# Altium project imu.PrjPcb
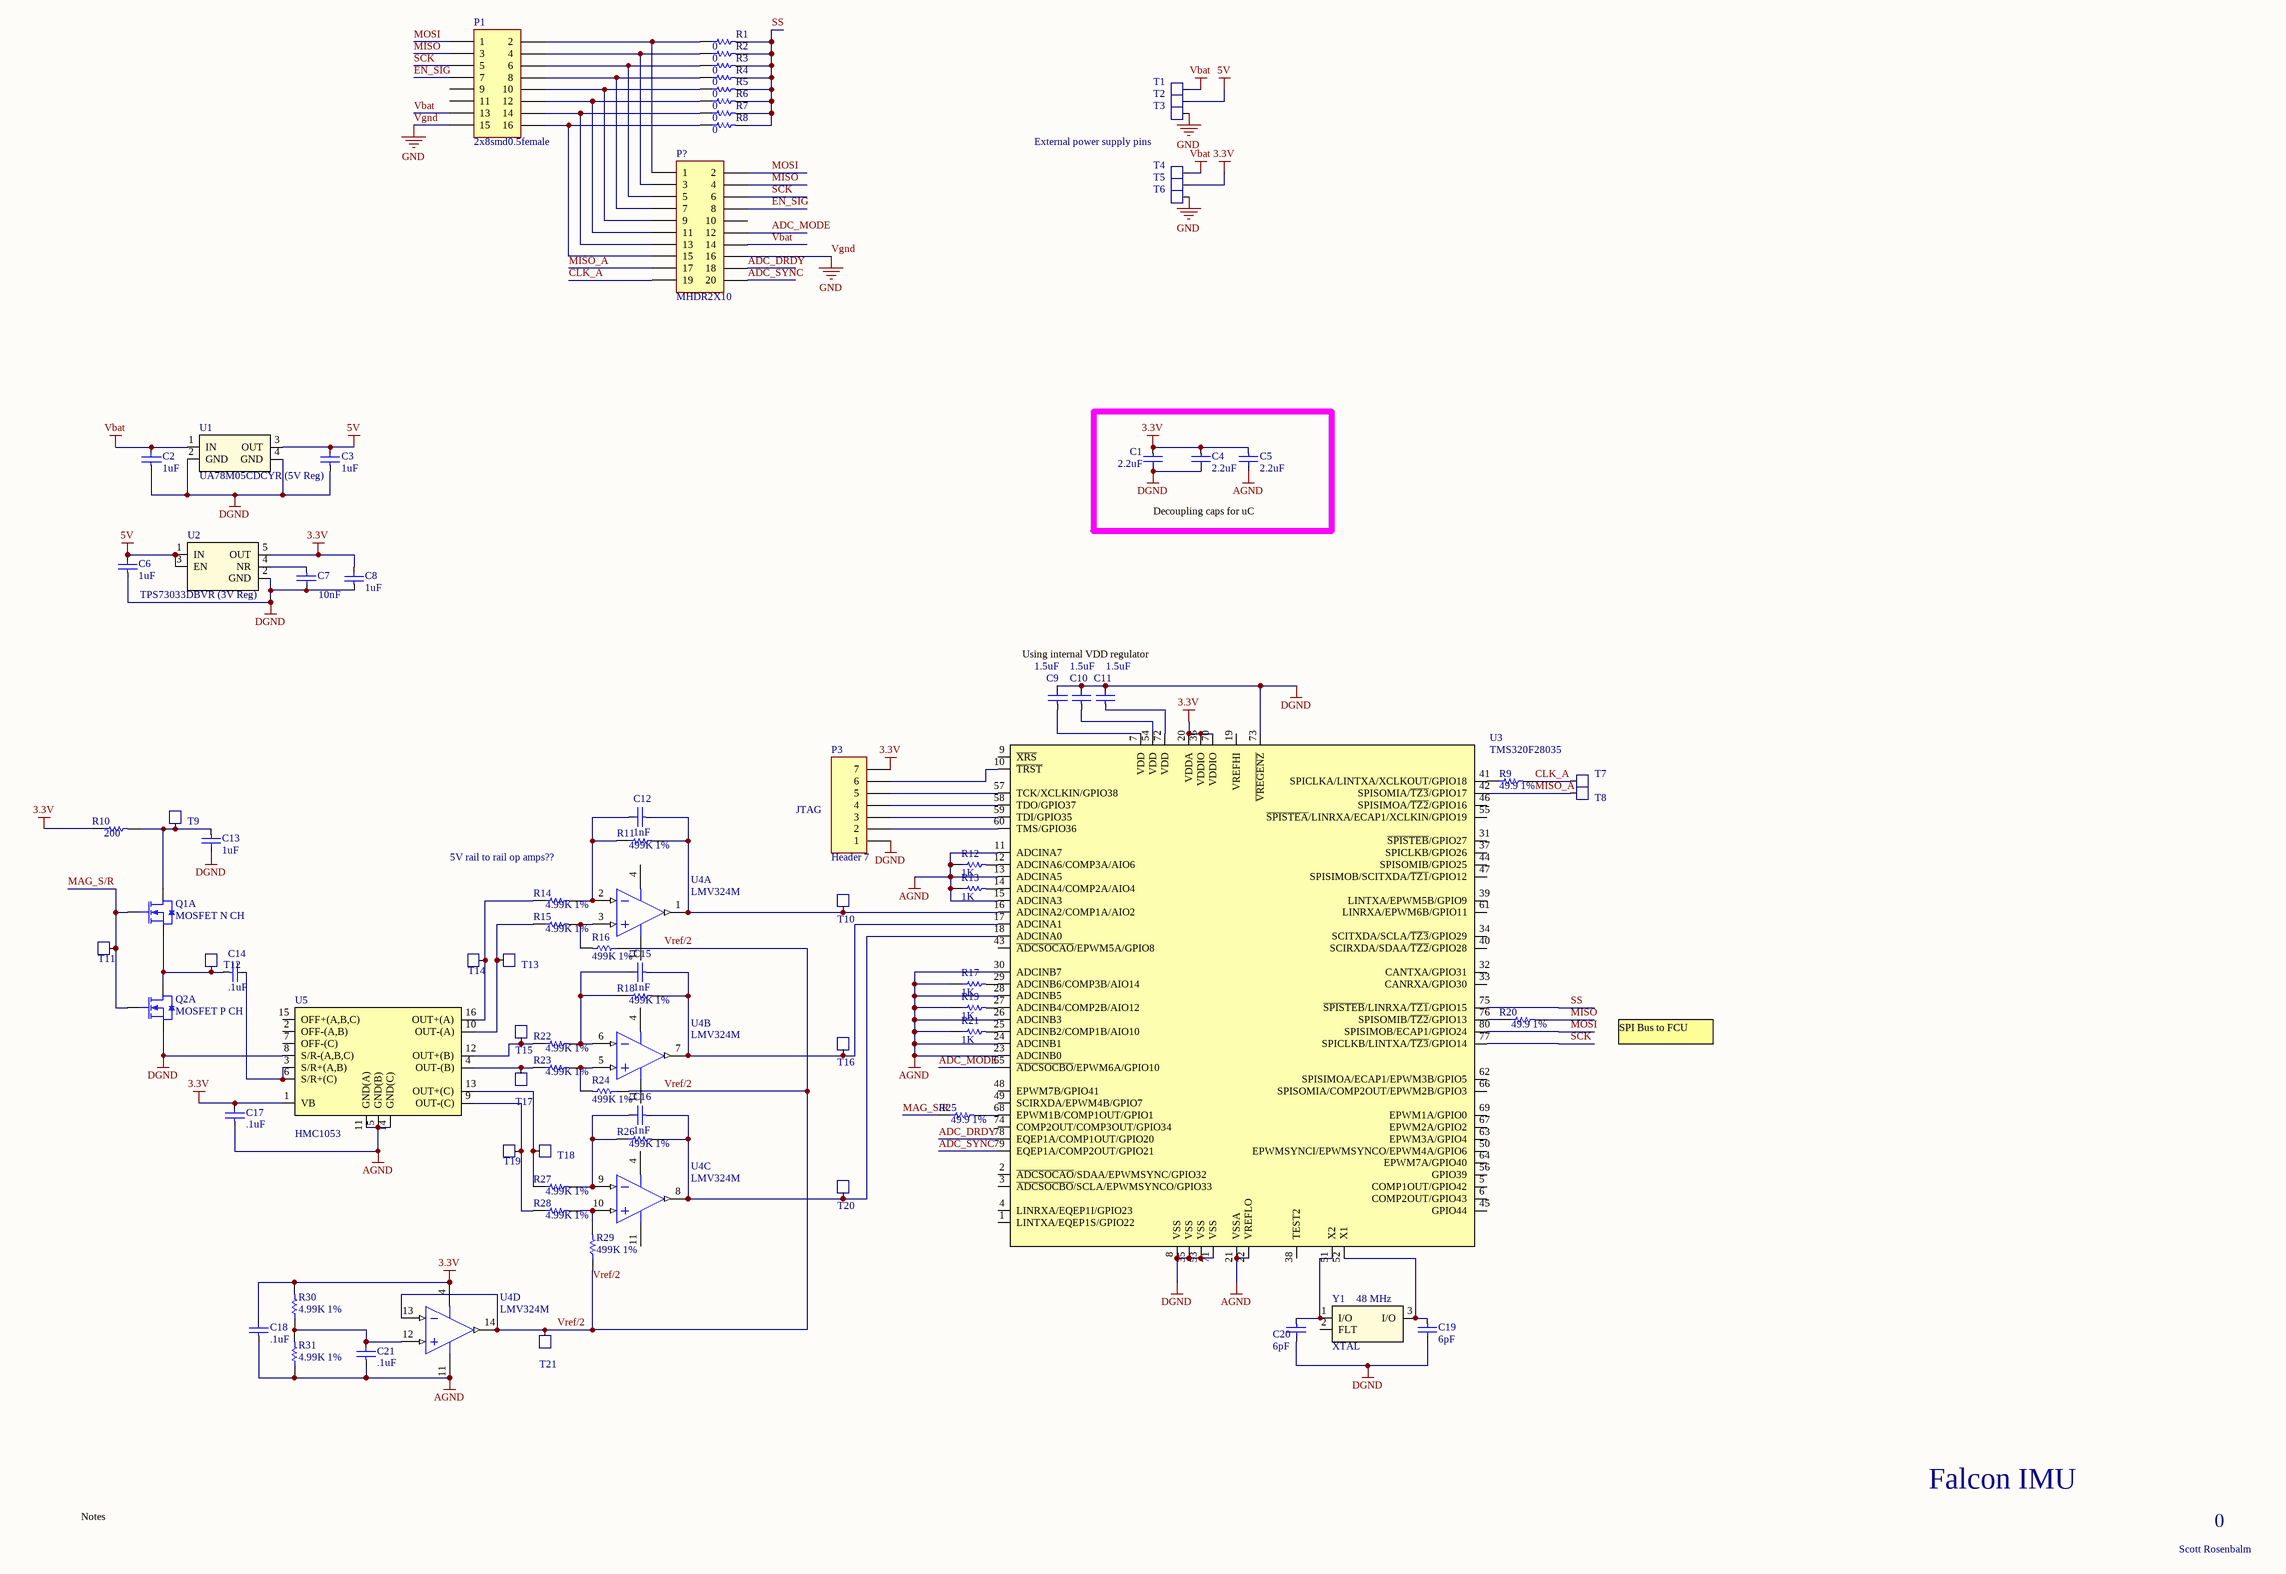
[diagram p0: imu.SchDoc]
3 sheets, 111 parts. Net scope: flat (ports and power ports of the same name join across sheets).
Board file: imu_2by2.PcbDoc
Sheets:
  imu.SchDoc
  gyro.SchDoc
  active_filter_2500Hz.SchDoc

## Sheet imu.SchDoc
size C; PageSetup: Record=PageOptions|CenterHorizontal=True|CenterVertical=True|PrintScale=0.62|XCorrection=1.00|YCorrection=1.00|PrintKind=1|BorderSize=5000000|LeftOffset=0|BottomOffset=0|Orientation=2|PaperLength=1000|PaperWidth=1000|Scale=100|PaperSource=7|PrintQuality=-4|MediaType=1|DitherType=10|PaperKind=Letter|PrintScaleMode=0

### Parts
(Parts that share a designator on the sheet are numbered #1, #2 ... from top to bottom, then left to right.)
C1  value 2.2uF  [0603 (1608)]  (hidden comment: Capacitor)
C2  value 1uF  [0603 (1608)]  (hidden comment: Capacitor)
C3  1uF  [0603 (1608)]
C4  value 2.2uF  [0603 (1608)]  (hidden comment: Capacitor)
C5  value 2.2uF  [0603 (1608)]  (hidden comment: Capacitor)
C6  1uF  [0603 (1608)]
C7  10nF  [0603 (1608)]
C8  1uF  [0603 (1608)]
C9  1.5uF  [0805 (2012)]
C10  1.5uF  [0805 (2012)]
C11  1.5uF  [0805 (2012)]
C12  1nF  [0603 (1608)]
C13  1uF  [0603 (1608)]
C14  value .1uF  [0603 (1608)]  (hidden comment: Capacitor)
C15  1nF  [0603 (1608)]
C16  1nF  [0603 (1608)]
C17  value .1uF  [0603 (1608)]  (hidden comment: Capacitor)
C18  value .1uF  [0603 (1608)]  (hidden comment: Capacitor)
C19#1  6pF  [0603 (1608)]
C20#1  6pF  [0603 (1608)]
C21#1  value .1uF  [0603 (1608)]  (hidden comment: Capacitor)
P1  2x8smd0.5female  [S9007E-08-ND]
P3  Header 7  [HDR1X7]
P?  MHDR2X10  [S9013E-10-ND]
Q1  MOSFET N CH  [SOT563F]  (part A of 2)
Q2  MOSFET P CH  [SOT563F]  (part A of 2)
R1  value 0  [0603 (1608)]  (hidden comment: Res1)
R2  value 0  [0603 (1608)]  (hidden comment: Res1)
R3  value 0  [0603 (1608)]  (hidden comment: Res1)
R4  value 0  [0603 (1608)]  (hidden comment: Res1)
R5  value 0  [0603 (1608)]  (hidden comment: Res1)
R6  value 0  [0603 (1608)]  (hidden comment: Res1)
R7  value 0  [0603 (1608)]  (hidden comment: Res1)
R8  value 0  [0603 (1608)]  (hidden comment: Res1)
R9  value 49.9 1%  [0603 (1608)]  (hidden comment: 931 1%)
R10  200  [0603 (1608)]
R11  499K 1%  [0603 (1608)]
R12  1K  [0603 (1608)]
R13  1K  [0603 (1608)]
R14  value 4.99K 1%  [0603 (1608)]  (hidden comment: Res1)
R15  value 4.99K 1%  [0603 (1608)]  (hidden comment: Res1)
R16  499K 1%  [0603 (1608)]
R17  1K  [0603 (1608)]
R18  499K 1%  [0603 (1608)]
R19  1K  [0603 (1608)]
R20  value 49.9 1%  [0603 (1608)]  (hidden comment: 931 1%)
R21  1K  [0603 (1608)]
R22  value 4.99K 1%  [0603 (1608)]  (hidden comment: Res1)
R23  value 4.99K 1%  [0603 (1608)]  (hidden comment: Res1)
R24  499K 1%  [0603 (1608)]
R25#1  value 49.9 1%  [0603 (1608)]  (hidden comment: 931 1%)
R26#1  499K 1%  [0603 (1608)]
R27  value 4.99K 1%  [0603 (1608)]  (hidden comment: Res1)
R28  value 4.99K 1%  [0603 (1608)]  (hidden comment: Res1)
R29  499K 1%  [0603 (1608)]
R30  value 4.99K 1%  [0603 (1608)]  (hidden comment: Res1)
R31  value 4.99K 1%  [0603 (1608)]  (hidden comment: Res1)
T1  TEST_PAD  [TEST_PAD]  (value not drawn)
T2  TEST_PAD  [TEST_PAD]  (value not drawn)
T3  TEST_PAD  [TEST_PAD]  (value not drawn)
T4  TEST_PAD  [TEST_PAD]  (value not drawn)
T5  TEST_PAD  [TEST_PAD]  (value not drawn)
T6  TEST_PAD  [TEST_PAD]  (value not drawn)
T7  (no value)  [TEST_PAD]
T8  (no value)  [TEST_PAD]
T9  (no value)  [TEST_PAD]
T10  (no value)  [TEST_PAD]
T11  (no value)  [TEST_PAD]
T12  (no value)  [TEST_PAD]
T13  (no value)  [TEST_PAD]
T14  (no value)  [TEST_PAD]
T15  (no value)  [TEST_PAD]
T16  (no value)  [TEST_PAD]
T17  (no value)  [TEST_PAD]
T18  (no value)  [TEST_PAD]
T19  (no value)  [TEST_PAD]
T20  (no value)  [TEST_PAD]
T21  (no value)  [TEST_PAD]
U1  UA78M05CDCYR (5V Reg)  [SOT233 (Ti voltage reg)]
U2#1  TPS73033DBVR (3V Reg)  [SOT23-5 (Ti 3.3V Reg)]
U3  TMS320F28035  [TS-PQFP-G80]
U4  LMV324M  [M14A_N]  (parts A,B,C,D of 4)
U5  HMC1053  [LCC-16]
Y1  XTAL  Frequency: 48 MHz  [Murata XTAL]

### Blocks framed on the sheet
Decoupling caps for uC: C1 C4 C5

### Nets
3.3V: C1.2 C4.2 C5.2 C8.1 C17.1 C18.1 P3.7 R10.1 R30.2 T5.0 U2#1.5(OUT) U3.20(VDDA) U3.36(VDDIO) U3.70(VDDIO) U4.4(V+) U5.1(VB)
5V: C3.1 C6.1 T2.0 U1.3(OUT) U2#1.1(IN) U2#1.3(EN)
AGND: C5.1 C17.2 C18.2 C21#1.2 R12.1 R13.1 R17.1 R19.1 R21.1 R31.1 U3.11(ADCINA7) U3.13(ADCINA5) U3.15(ADCINA3) U3.21(VSSA) U3.22(VREFLO) U3.23(ADCINB0) U3.24(ADCINB1) U3.26(ADCINB3) U3.28(ADCINB5) U3.30(ADCINB7) U4.11(V-) U5.5(GND(B)) U5.11(GND(A)) U5.14(GND(C))
DGND: C1.1 C2.2 C3.2 C4.1 C6.2 C7.1 C8.2 C9.1 C10.1 C11.1 C13.1 C19#1.1 C20#1.1 P3.1 Q2.1(S1) U1.2(GND) U1.4(GND) U2#1.2(GND) U3.8(VSS) U3.35(VSS) U3.53(VSS) U3.71(VSS) U3.73(~{VREGENZ}) U5.8(S/R-(A,B,C))
Vbat: C2.1 P1.13 P?.14 T1.0 T4.0 U1.1(IN)
Vgnd: P1.15 P?.16 T3.0 T6.0  [also labelled GND]
ADC_DRDY: P?.18 U3.78(EQEP1A/COMP1OUT/GPIO20)
ADC_MODE: P?.12 U3.65(~{ADCSOCBO}/EPWM6A/GPIO10)
ADC_SYNC: P?.20 U3.79(EQEP1A/COMP2OUT/GPIO21)
CLK_A: P?.19 R9.2 T7.0
EN_SIG: P1.7 P?.8
MAG_S/R: Q1.2(G1) Q2.2(G1) R25#1.1 T11.0
MISO: P1.3 P?.4 R20.2
MISO_A: P?.17 T8.0 U3.42(SPISOMIA/~{TZ3}/GPIO17)
MOSI: P1.1 P?.2 U3.80(SPISIMOB/ECAP1/GPIO24)
SCK: P1.5 P?.6 U3.77(SPICLKB/LINTXA/~{TZ3}/GPIO14)
SS: R1.2 R2.2 R3.2 R4.2 R5.2 R6.2 R7.2 R8.2 U3.75(~{SPISTEB}/LINRXA/~{TZ1}/GPIO15)
Vref/2: R16.1 R24.1 R29.1 T21.0 U4.13(IND-) U4.14(OUTD)
NetC7_2: C7.2 U2#1.4(NR)
NetC9_2: C9.2 U3.7(VDD)
NetC10_2: C10.2 U3.54(VDD)
NetC11_2: C11.2 U3.72(VDD)
NetC12_1: C12.1 R11.1 R14.2 U4.2(INA-)
NetC12_2: C12.2 R11.2 T10.0 U3.16(ADCINA2/COMP1A/AIO2) U4.1(OUTA)
NetC13_2: C13.2 Q1.6(D1) R10.2 T9.0
NetC14_1: C14.1 U5.3(S/R+(A,B)) U5.6(S/R+(C))
NetC14_2: C14.2 Q1.1(S1) Q2.6(D1) T12.0
NetC15_1: C15.1 R18.1 R22.2 U4.6(INB-)
NetC15_2: C15.2 R18.2 T16.0 U3.17(ADCINA1) U4.7(OUTB)
NetC16_1: C16.1 R26#1.1 R27.2 U4.9(INC-)
NetC16_2: C16.2 R26#1.2 T20.0 U3.18(ADCINA0) U4.8(OUTC)
NetC19#1_2: C19#1.2 U3.52(X1) Y1.3(I/O)
NetC20#1_2: C20#1.2 U3.51(X2) Y1.1(I/O)
NetC21#1_1: C21#1.1 R30.1 R31.2 U4.12(IND+)
NetP1_2: P1.2 P?.1 R1.1
NetP1_4: P1.4 P?.3 R2.1
NetP1_6: P1.6 P?.5 R3.1
NetP1_8: P1.8 P?.7 R4.1
NetP1_10: P1.10 P?.9 R5.1
NetP1_12: P1.12 P?.11 R6.1
NetP1_14: P1.14 P?.13 R7.1
NetP1_16: P1.16 P?.15 R8.1
NetP3_2: P3.2 U3.60(TMS/GPIO36)
NetP3_3: P3.3 U3.59(TDI/GPIO35)
NetP3_4: P3.4 U3.58(TDO/GPIO37)
NetP3_5: P3.5 U3.57(TCK/XCLKIN/GPIO38)
NetP3_6: P3.6 U3.10(~{TRST})
NetR9_1: R9.1 U3.41(SPICLKA/LINTXA/XCLKOUT/GPIO18)
NetR12_2: R12.2 U3.12(ADCINA6/COMP3A/AIO6)
NetR13_2: R13.2 U3.14(ADCINA4/COMP2A/AIO4)
NetR14_1: R14.1 T14.0 U5.16(OUT+(A))
NetR15_1: R15.1 T13.0 U5.10(OUT-(A))
NetR15_2: R15.2 R16.2 U4.3(INA+)
NetR17_2: R17.2 U3.29(ADCINB6/COMP3B/AIO14)
NetR19_2: R19.2 U3.27(ADCINB4/COMP2B/AIO12)
NetR20_1: R20.1 U3.76(SPISOMIB/~{TZ2}/GPIO13)
NetR21_2: R21.2 U3.25(ADCINB2/COMP1B/AIO10)
NetR22_1: R22.1 T15.0 U5.12(OUT+(B))
NetR23_1: R23.1 T17.0 U5.4(OUT-(B))
NetR23_2: R23.2 R24.2 U4.5(INB+)
NetR25#1_2: R25#1.2 U3.68(EPWM1B/COMP1OUT/GPIO1)
NetR27_1: R27.1 T18.0 U5.13(OUT+(C))
NetR28_1: R28.1 T19.0 U5.9(OUT-(C))
NetR28_2: R28.2 R29.2 U4.10(INC+)

Not connected (* = marked no-connect by the designer): P1 9 11; P? 10; U3 1(LINTXA/EQEP1S/GPIO22) 2(~{ADCSOCAO}/SDAA/EPWMSYNC/GPIO32) 3(~{ADCSOCBO}/SCLA/EPWMSYNCO/GPIO33) 4(LINRXA/EQEP1I/GPIO23) 5(COMP1OUT/GPIO42) 6(COMP2OUT/GPIO43) 9(~{XRS}) 19(VREFHI) 31(~{SPISTEB}/GPIO27) 32(CANTXA/GPIO31) 33(CANRXA/GPIO30) 34(SCITXDA/SCLA/~{TZ3}/GPIO29) 37(SPICLKB/GPIO26) 38(TEST2) 39(LINTXA/EPWM5B/GPIO9) 40(SCIRXDA/SDAA/~{TZ2}/GPIO28) 43(~{ADCSOCAO}/EPWM5A/GPIO8) 44(SPISOMIB/GPIO25) 45(GPIO44) 46(SPISIMOA/~{TZ2}/GPIO16) 47(SPISIMOB/SCITXDA/~{TZ1}/GPIO12) 48(EPWM7B/GPIO41) 49(SCIRXDA/EPWM4B/GPIO7) 50(EPWMSYNCI/EPWMSYNCO/EPWM4A/GPIO6) 55(~{SPISTEA}/LINRXA/ECAP1/XCLKIN/GPIO19) 56(GPIO39) 61(LINRXA/EPWM6B/GPIO11) 62(SPISIMOA/ECAP1/EPWM3B/GPIO5) 63(EPWM3A/GPIO4) 64(EPWM7A/GPIO40) 66(SPISOMIA/COMP2OUT/EPWM2B/GPIO3) 67(EPWM2A/GPIO2) 69(EPWM1A/GPIO0) 74(COMP2OUT/COMP3OUT/GPIO34); U5 2(OFF-(A,B)) 7(OFF-(C)) 15(OFF+(A,B,C)); Y1 2(FLT)

### Notes on the sheet
- External power supply pins
- Using internal VDD regulator
- JTAG
- 5V rail to rail op amps??
- SPI Bus to FCU
- Falcon IMU
- Notes to self:
  Tie VREGENZ low, use internal 1.8V ref for uC VDD.
  uC ADC -> use internal 3.3V reference.
  Use TDM mode, fixed position data on ads1178.
  The differential opamps provide an active low-pass filter. Look at http://focus.ti.com/lit/an/sloa064a/sloa064a.pdf for more info on active filters with differential op amps.
  I believe with a feedback cap of 56nF, the -3dB frequency will be 2.7kHz, which will be acceptable for all our sensors. ADXRS620 reccomends a filter at the desired BW and at 5X the desired BW, to cut down on the 14kHz noise created by the modulation in the sensor. The passive low-pass at the output of the sensor provides a 500Hz filter, while the active filter provides the 2.5kHz filter recommended.
- Main Questions/Concerns:
  1. Switching power supply or linear regulator?
  Linear drop from 16.4V to 3.3V with 120mA of current is about 1.5W. sensors are somewhat temperature sensitive...
  Switching regulator:
  PROS: a lot less heat than linear.
  CONS: More power noise. Simulation said 0.2 mV ripple, not bad. more components/board space.
  - switching at same frequency as oscillator for ADC (1MHz). Bad?
  2. Does differential op amp provide ANY benifit when all the inputs are single ended anyway? Do I need ANY op amp? can I just feed 'raw' signals into ADC?
  3. Different ground planes? Not sure the best way to do that.
  4. App note for magnetometer HMC1053 says to apply Vref/2 to the non-inverting terminal of the op amps. I had an extra opamp available, so I used it to buffer the Vref/2 from a voltage divider. Is this a good idea, or should I use a different method? (see opamp directly under HMC1053).
  5. magnetometer has a Set/Reset functionality that demagnetizes the sensor periodically. It shoots around 500mA of current from a holding cap into the sensor, then pulls it out the other way. (This is the MOSFET pair thing). Should I put the Set/Reset stuff on DGND, while the rest of the sensor is on AGND? Is that possible/helpful?
  6. This is a little more nitty gritty, but concerning the ADC... The VREFP input should be 2.5V (just half of the AVDD i think). The appnote shows using another (ti) opamp and (ti) zener diode reference to supply the voltage to VREFP. But, the adc has a VCOM output, which is supposed to be AVDD/2 anyway, AND i am already using an opamp to buffer that output, so shouldn't I just route that back into VREFP?
- Scott Rosenbalm
- 0

### Library data of the parts
C1 C4 C5 = Capacitor: Manufacturer: TDK; Part No.: 445-5167-1-ND; Vendor: Digikey; Tolerance: 20%; Price Est.: $0.121
C2 C3 C6 C8 C13 = Capacitor: Manufacturer: Murata; Part No.: 490-3897-1-ND; Vendor: Digikey; Tolerance: 10%; Voltage: 25V; Price Est.: $0.079
  C3 C6 C8 C13: Value: 1uF
C7 = Capacitor: Manufacturer: TDK; Part No.: 445-5099-1-ND; Vendor: Digikey; Tolerance: 5%; Price Est.: $0.044; Value: 10nF
C9-C11 = Capacitor: Manufacturer: Murata; Part No.: 490-1740-1-ND; Vendor: Digikey; Price Est.: $0.202; Value: 1.5uF
C12 C15 C16 = Capacitor: Manufacturer: Murata; Part No.: 490-1451-1-ND; Vendor: Digikey; Tolerance: 5%; Price Est.: $0.043; Value: 1nF
C14 C17 C18 C21#1 = Capacitor: Manufacturer: Murata; Part No.: 490-1524-1-ND; Vendor: Digikey; Price Est.: $0.019
C19#1 C20#1 = Capacitor: Manufacturer: TDK; Part No.: 445-5036-1-ND; Vendor: Digikey; Tolerance: .25pF; Special: COG; Price Est.: $0.044; Value: 6pF
P1 = 2x8smd0.5female: Vendor: Digikey; Part No.: S9007E-08-ND; Price Est.: 1.43
P3 = Header 7: Header, 7-Pin; LatestRevisionDate: 17-Jul-2002; LatestRevisionNote: Re-released for DXP Platform.; Publisher: Altium Limited
P? = MHDR2X10: Header, 10-Pin, Dual row, Male; Vendor: Digikey; Part No.: S9013E-10-ND; Price Est.: $1.80
Q1 Q2 = MOSFETs: Part No.: SI1035X-T1-E3CT-ND; Manufacturer: Vishay Siliconx; Vendor: Digikey; Price Est.: $0.59
R1-R8 = Res1: Resistor; Published: 8-Jun-2000; LatestRevisionDate: 17-Jul-2002; LatestRevisionNote: Re-released for DXP Platform.; PackageReference: AXIAL-0.3; Publisher: Altium Limited
R9 R20 R25#1 = Res1: Resistor; Part No.: P49.9HCT-ND; Vendor: Digikey; Price Est.: $0.04
R10 = Res1: Resistor; Part No.: P200GCT-ND; Vendor: Digikey; Value: 200; Price Est.: $0.03
R11 R16 R18 R24 R26#1 R29 = Res1: Resistor; Part No.: P499KHCT-ND; Vendor: Digikey; Value: 499K 1%; Price Est.: $0.04
R12 R13 R17 R19 R21 = Res1: Resistor; Part No.: P1.0KGCT-ND; Vendor: Digikey; Estimated Cost: $0.03; Tolerance: 5%; Value: 1K
R14 R15 R22 R23 R27 R28 R30 R31 = Res1: Resistor; Part No.: P4.99KHCT-ND; Vendor: Digikey; Price Est.: $0.04
T7-T21 = TEST_PAD
U1 = UA78M05CDCYR (5V Reg): Part No.: 296-12290-1-ND; Vendor: Digikey; Price Est.: $0.70
U2#1 = TPS73033DBVR (3V Reg): Part No.: 296-17580-1-ND; Vendor: Digikey; Price Est.: $0.85
U3 = TMS320F28035 (80-pin): 80-pin; Manufacturer: Texas Instruments; Part No.: TMS320F28035PNS-ND; Vendor: Digikey; Price Est.: $15
U4 = LMV324M: General Purpose, Low Voltage, Rail-to-Rail Output Operational Amplifiers; Manufacturer: National Semiconductor; PackageTopMarking: NSUZXYTT*LMV324M; PowerWise: N; Published: 4-Dec-2008; LatestRevisionDate: 13-Jan-2009; LatestRevisionNote: Sim Model Added.; DatasheetVersion: Oct-2007; PackageVersion: revJ, Jan-1996; PackageReference: M14A; Publisher: Altium Limited; PackageDescription: Molded Package S.O., .150in Wide, 14 Lead; CompType: Amplifiers; PartNumber: LMV324M; RoHS: O; PinCount: 14; DigiKeyPartNumber: LMV324MXCT-ND; Code_JEDEC: MS-012AB; Code_IPC: SOIC127P600-14; ComponentLink1Description: LMV324 Datasheet; ComponentLink1URL: http://www.national.com/ds/LM/LMV324.pdf; ComponentLink2Description: LMV324 Web Page; ComponentLink2URL: http://www.national.com/pf/LM/LMV324.html; ComponentLink3Description: M14A Package Page; ComponentLink3URL: http://www.national.com/packaging/folders/m14a.html
Y1 = XTAL: Part No.: 490-5588-1-ND; Vendor: Digikey; Price Est.: $0.80

## Sheet gyro.SchDoc
size A
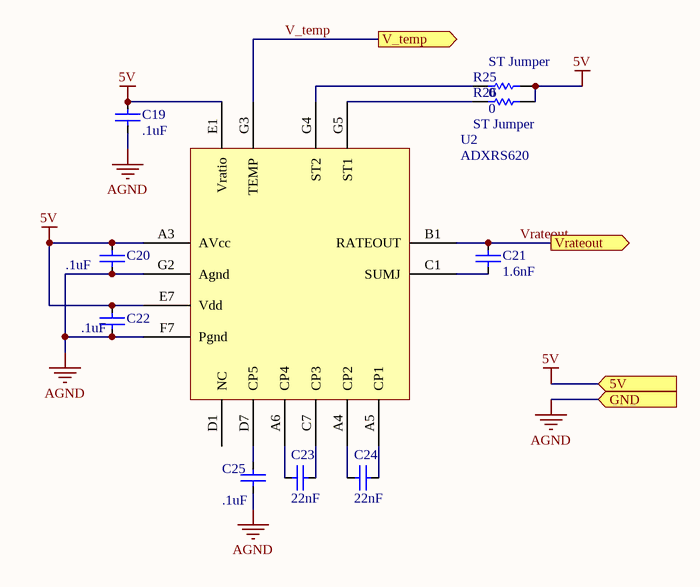
[diagram p1: gyro.SchDoc]

### Parts
(Parts that share a designator on the sheet are numbered #1, #2 ... from top to bottom, then left to right.)
C19#2  value .1uF  [0603 (1608)]  (hidden comment: Capacitor)
C20#2  value .1uF  [0603 (1608)]  (hidden comment: Capacitor)
C21#2  value 1.6nF  [0603 (1608)]  (hidden comment: Capacitor)
C22  value .1uF  [0603 (1608)]  (hidden comment: Capacitor)
C23  value 22nF  [0603 (1608)]  (hidden comment: Capacitor)
C24  value 22nF  [0603 (1608)]  (hidden comment: Capacitor)
C25  value .1uF  [0603 (1608)]  (hidden comment: Capacitor)
R25#2  ST Jumper  value 0  [0603 (1608)]
R26#2  ST Jumper  value 0  [0603 (1608)]
U2#2  ADXRS620  [BGA_AXDR]

### Ports
5V (in), GND (in), V_temp (out), Vrateout (out)

### Nets
5V: C19#2.1 C20#2.1 C22.1 R25#2.2 R26#2.2 U2#2.A3(AVcc) U2#2.E1(Vratio) U2#2.E7(Vdd) ; port 5V
AGND: C19#2.2 C20#2.2 C22.2 C25.2 U2#2.F7(Pgnd) U2#2.G2(Agnd) ; port GND
V_temp: U2#2.G3(TEMP) ; port V_temp
Vrateout: C21#2.2 U2#2.B1(RATEOUT) ; port Vrateout
NetC21#2_1: C21#2.1 U2#2.C1(SUMJ)
NetC23_1: C23.1 U2#2.A6(CP4)
NetC23_2: C23.2 U2#2.C7(CP3)
NetC24_1: C24.1 U2#2.A4(CP2)
NetC24_2: C24.2 U2#2.A5(CP1)
NetC25_1: C25.1 U2#2.D7(CP5)
NetR25#2_1: R25#2.1 U2#2.G4(ST2)
NetR26#2_1: R26#2.1 U2#2.G5(ST1)

Not connected (* = marked no-connect by the designer): U2#2 D1(NC)

### Library data of the parts
C19#2 C20#2 C22 C25 = Capacitor: as C14 on sheet imu; Price Est.: $0.019
C21#2 = Capacitor: Manufacturer: Murata; Part No.: 490-1456-1-ND; Vendor: Digikey; Price Est.: $0.084
C23 C24 = Capacitor: Manufacturer: TDK; Part No.: 445-5104-1-ND; Vendor: Digikey; Price Est.: $0.03
R25#2 R26#2 = Res1: Resistor

## Sheet active_filter_2500Hz.SchDoc
size A
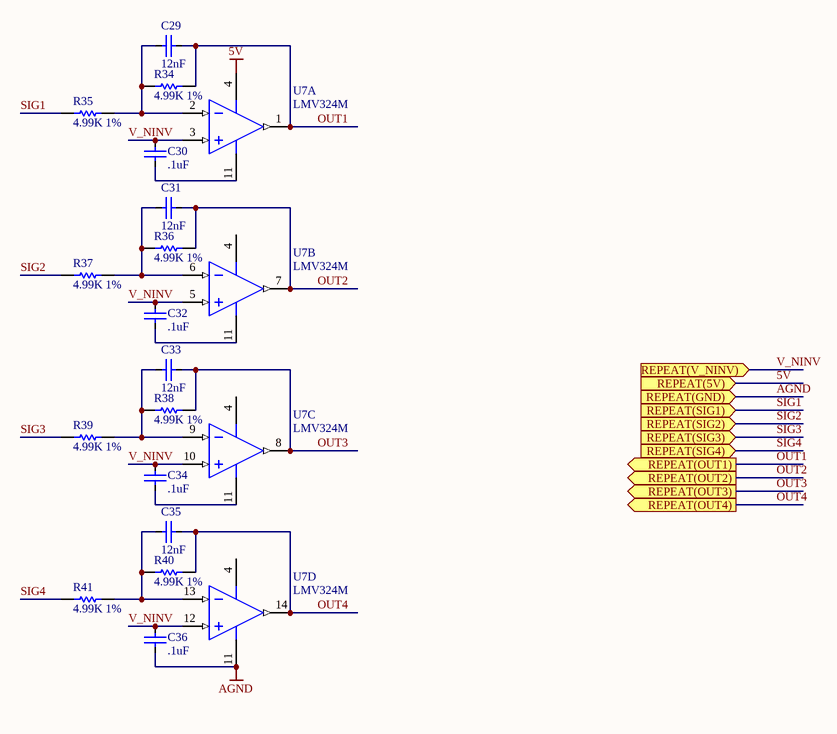
[diagram p2: active_filter_2500Hz.SchDoc]

### Parts
C29  value 12nF  [0603 (1608)]  (hidden comment: Capacitor)
C30  value .1uF  [0603 (1608)]  (hidden comment: Capacitor)
C31  value 12nF  [0603 (1608)]  (hidden comment: Capacitor)
C32  value .1uF  [0603 (1608)]  (hidden comment: Capacitor)
C33  value 12nF  [0603 (1608)]  (hidden comment: Capacitor)
C34  value .1uF  [0603 (1608)]  (hidden comment: Capacitor)
C35  value 12nF  [0603 (1608)]  (hidden comment: Capacitor)
C36  value .1uF  [0603 (1608)]  (hidden comment: Capacitor)
R34  value 4.99K 1%  [0603 (1608)]  (hidden comment: Res1)
R35  value 4.99K 1%  [0603 (1608)]  (hidden comment: Res1)
R36  value 4.99K 1%  [0603 (1608)]  (hidden comment: Res1)
R37  value 4.99K 1%  [0603 (1608)]  (hidden comment: Res1)
R38  value 4.99K 1%  [0603 (1608)]  (hidden comment: Res1)
R39  value 4.99K 1%  [0603 (1608)]  (hidden comment: Res1)
R40  value 4.99K 1%  [0603 (1608)]  (hidden comment: Res1)
R41  value 4.99K 1%  [0603 (1608)]  (hidden comment: Res1)
U7  LMV324M  [M14A_N]  (parts A,B,C,D of 4)

### Ports
REPEAT(5V) (in), REPEAT(GND) (in), REPEAT(OUT1) (out), REPEAT(OUT2) (out), REPEAT(OUT3) (out), REPEAT(OUT4) (out), REPEAT(SIG1) (in), REPEAT(SIG2) (in), REPEAT(SIG3) (in), REPEAT(SIG4) (in), REPEAT(V_NINV) (in)

### Nets
5V: U7.4(V+) ; port REPEAT(5V)
AGND: C36.2 U7.11(V-) ; port REPEAT(GND)
OUT1: C29.2 R34.1 U7.1(OUTA) ; port REPEAT(OUT1)
OUT2: C31.2 R36.1 U7.7(OUTB) ; port REPEAT(OUT2)
OUT3: C33.2 R38.1 U7.8(OUTC) ; port REPEAT(OUT3)
OUT4: C35.2 R40.1 U7.14(OUTD) ; port REPEAT(OUT4)
SIG1: R35.2 ; port REPEAT(SIG1)
SIG2: R37.2 ; port REPEAT(SIG2)
SIG3: R39.2 ; port REPEAT(SIG3)
SIG4: R41.2 ; port REPEAT(SIG4)
V_NINV: C30.1 C32.1 C34.1 C36.1 U7.3(INA+) U7.5(INB+) U7.10(INC+) U7.12(IND+) ; port REPEAT(V_NINV)
NetC29_1: C29.1 R34.2 R35.1 U7.2(INA-)
NetC30_2: C30.2 U7.11(V-)
NetC31_1: C31.1 R36.2 R37.1 U7.6(INB-)
NetC32_2: C32.2 U7.11(V-)
NetC33_1: C33.1 R38.2 R39.1 U7.9(INC-)
NetC34_2: C34.2 U7.11(V-)
NetC35_1: C35.1 R40.2 R41.1 U7.13(IND-)

### Library data of the parts
C29 C31 C33 C35 = Capacitor: Manufacturer: Murata; Part No.: 490-1513-1-ND; Vendor: Digikey; Price Est.: $0.062
C30 C32 C34 C36 = Capacitor: as C14 on sheet imu; Price Est.: $0.019
R34-R41 = Res1: as R14 on sheet imu; Price Est.: $0.04
U7 = LMV324M: as U4 on sheet imu; Published: 4-Dec-2008; LatestRevisionDate: 13-Jan-2009; LatestRevisionNote: Sim Model Added.; DatasheetVersion: Oct-2007; PackageVersion: revJ, Jan-1996; PackageReference: M14A; Publisher: Altium Limited; PackageDescription: Molded Package S.O., .150in Wide, 14 Lead; CompType: Amplifiers; PartNumber: LMV324M; RoHS: O; PinCount: 14; DigiKeyPartNumber: LMV324MXCT-ND; Code_JEDEC: MS-012AB; Code_IPC: SOIC127P600-14; ComponentLink1Description: LMV324 Datasheet; ComponentLink1URL: http://www.national.com/ds/LM/LMV324.pdf; ComponentLink2Description: LMV324 Web Page; ComponentLink2URL: http://www.national.com/pf/LM/LMV324.html; ComponentLink3Description: M14A Package Page; ComponentLink3URL: http://www.national.com/packaging/folders/m14a.html

## Nets that join several sheets
5V: imu (6 pins), gyro (8 pins), active_filter_2500Hz (U7.4)
AGND: imu (24 pins), gyro (6 pins), active_filter_2500Hz (C36.2 U7.11)